# EasyEDA schematic SCH_Thermostat-mk2.json
TITLE: Thermostat Mark 2; REV: 1.0; Date: 2024-02-11; Sheet: 1/1; Company: Danny Andersen
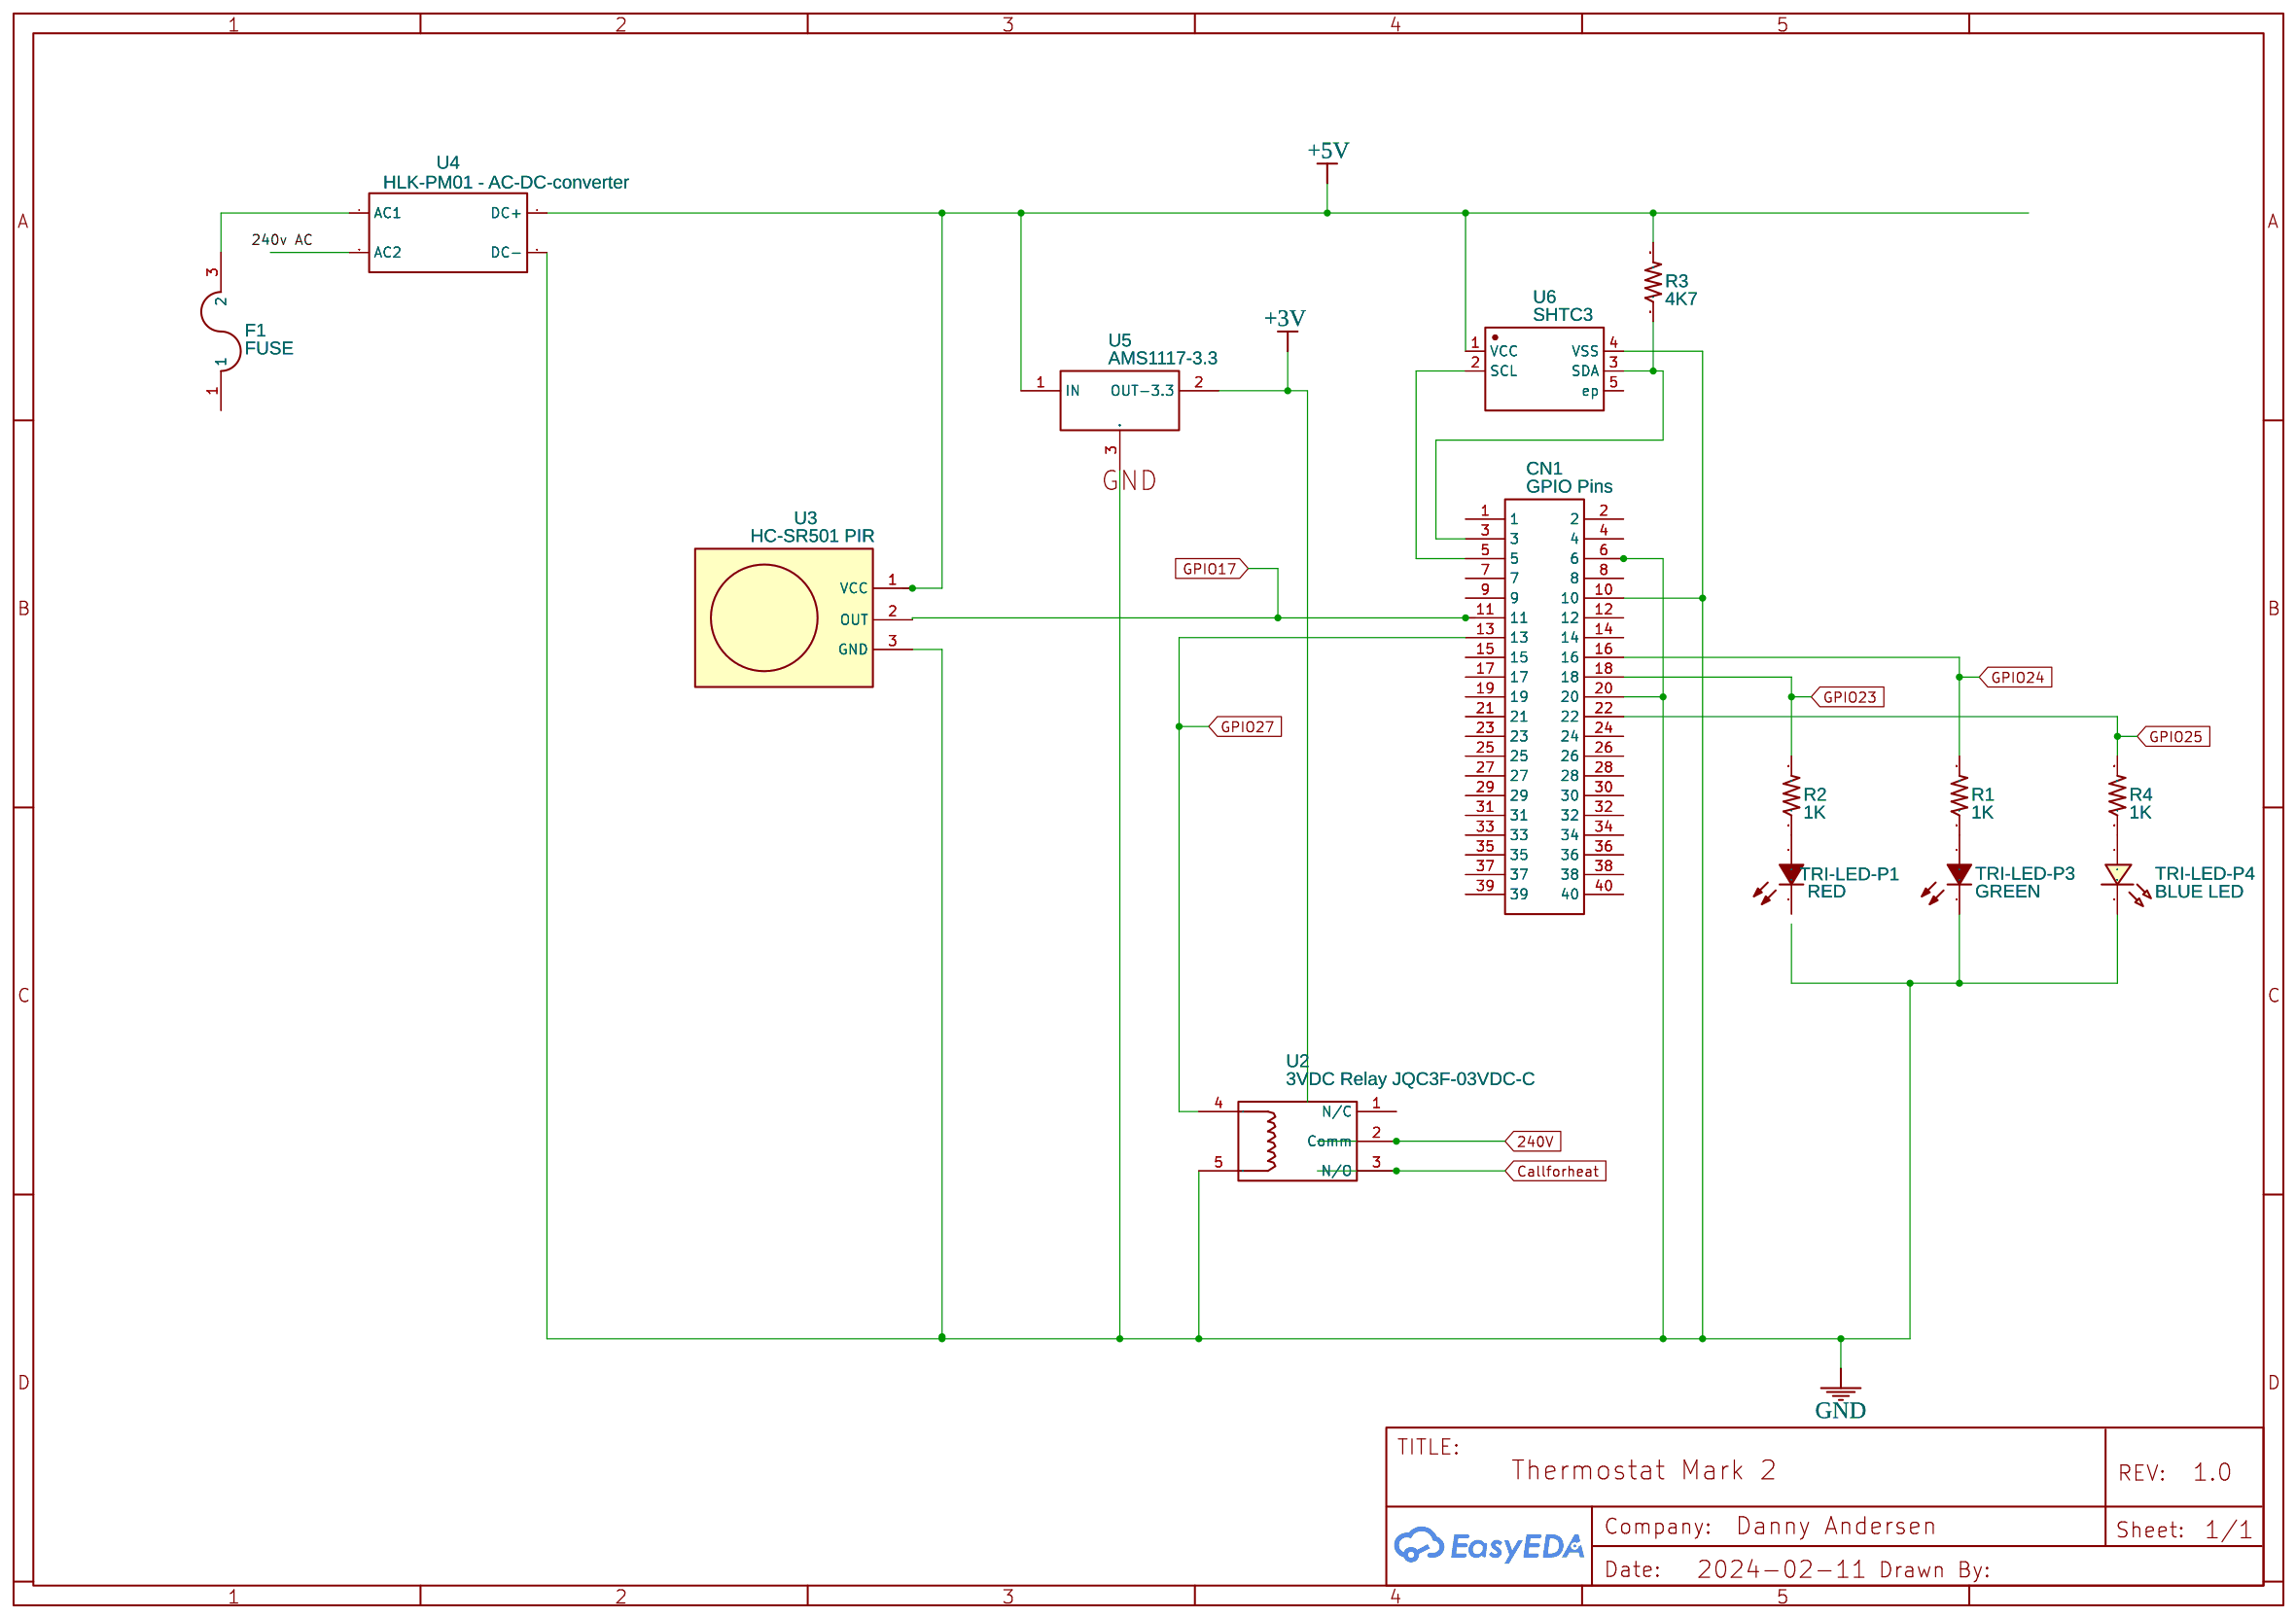
[diagram p0: schematic sheet]

## Parts
CN1  GPIO Pins  [HDR-TH_40P-V-H-R2-P2.54]
F1  FUSE  [FUSE_5MM]
R1  1K  [AXIAL-0.4]
R2  1K  [AXIAL-0.4]
R3  4K7  [AXIAL-0.4]
R4  1K  [AXIAL-0.4]
TRI-LED-P1  RED  [LED-TH_LED-DP2-2LED-AMCC]
TRI-LED-P3  GREEN  [LED-TH_LED-DP2-2LED-AMCC]
TRI-LED-P4  BLUE LED  [LED0603_RED]
U2  3VDC Relay JQC3F-03VDC-C  [JQC3F-05VDC-C]
U3  HC-SR501 PIR
U4  HLK-PM01 - AC-DC-converter  [HLK-PM01]
U5  AMS1117-3.3  [SOT-89-3_L4.5-W2.5-P1.50-LS4.2-BR]
U6  SHTC3  [SENSORM-SMD_4P-L2.0-W2.0-P1.00]

## Library data of the parts
CN1 = Crimping terminals2*20: Supplier: LCSC; Manufacturer: BOOMELE(博穆精密); Manufacturer Part: 2.54-2*20P压线头; Supplier Part: C21856; JLCPCB Part Class: Extended Part; link: https://lcsc.com/eda_search?q=C21856&%26type=1&ref=editor
F1 R1-R4 = -: catid: 20; Contributor: SparkFun; Manufacturer Part: ?
TRI-LED-P1 TRI-LED-P3 = LED: Supplier: Digi-Key; Manufacturer: VccLite; Manufacturer Part: 5600; Supplier Part: L20325-ND; link: https://vcclite.com/product/5602f5-5v/; Contributor: tanapong982
TRI-LED-P4 = LED-0603_R: Manufacturer: EVERLIGHT(台湾亿光); Manufacturer Part: 19-217/R6C-AL1M2VY/3T; Supplier Part: C72044; Supplier: LCSC; Contributor: LCEDA_01
U2 = 3VDC Relay JQC3F-03VDC-C: Contributor: eate.edwin.mamani.pi
U3 = -: Contributor: exersizze; sourceId: COI0iASar; Manufacturer Part: ?
U4 = -: catid: 20; sourceId: u1BzxTRca; Manufacturer Part: ?
U5 = 7805(SOT-89): Supplier: LCSC; Manufacturer: CJ; Manufacturer Part: CJ78L05; image: //image.lceda.cn/szlcsc/C2079.jpg; Supplier Part: C2079; Paste Type: expand; Contributor: LCEDA_Lib
U6 = SHTC3: Contributor: LCSC; Supplier: LCSC; Supplier Part: C194656; Manufacturer: Sensirion(瑞士盛思锐); Manufacturer Part: SHTC3-TR-2.5KS; JLCPCB Part Class: Extended Part

## Nets
240V: U2.2(Comm)
+3V: U5.2(OUT-3.3)
+5V: R3.P$2(2) U3.1(VCC) U4.4(DC+) U5.1(IN) U6.1(VCC)
GND: CN1.6 CN1.10 CN1.20 TRI-LED-P3.2(K) TRI-LED-P4.2 U2.5 U3.3(GND) U4.3(DC-) U5.3(GND) U6.4(VSS)
Callforheat: U2.3(N/O)
GPIO17: CN1.11 U3.2(OUT)
GPIO23: CN1.18 R2.P$2(2)
GPIO24: CN1.16 R1.P$2(2)
GPIO25: CN1.22 R4.P$2(2)
GPIO27: CN1.13 U2.4
Net-(CN1-3): CN1.3 R3.P$1(1) U6.3(SDA)
Net-(CN1-5): CN1.5 U6.2(SCL)
Net-(F1-3): F1.3(2) U4.1(AC1)
Net-(R1-P$1): R1.P$1(1) TRI-LED-P3.1(A)
Net-(R2-P$1): R2.P$1(1) TRI-LED-P1.1(A)
Net-(R4-P$1): R4.P$1(1) TRI-LED-P4.1

Not connected (* = marked no-connect by the designer): CN1 1 2 4 7 8 9 12 14 15 17 19 21 23 24 25 26 27 28 29 30 31 32 33 34 35 36 37 38 39 40; F1 1; TRI-LED-P1 2(K); U2 1(N/C); U4 2(AC2); U6 5(ep)
